# EAGLE board untitled (EAGLE 6.6.0)
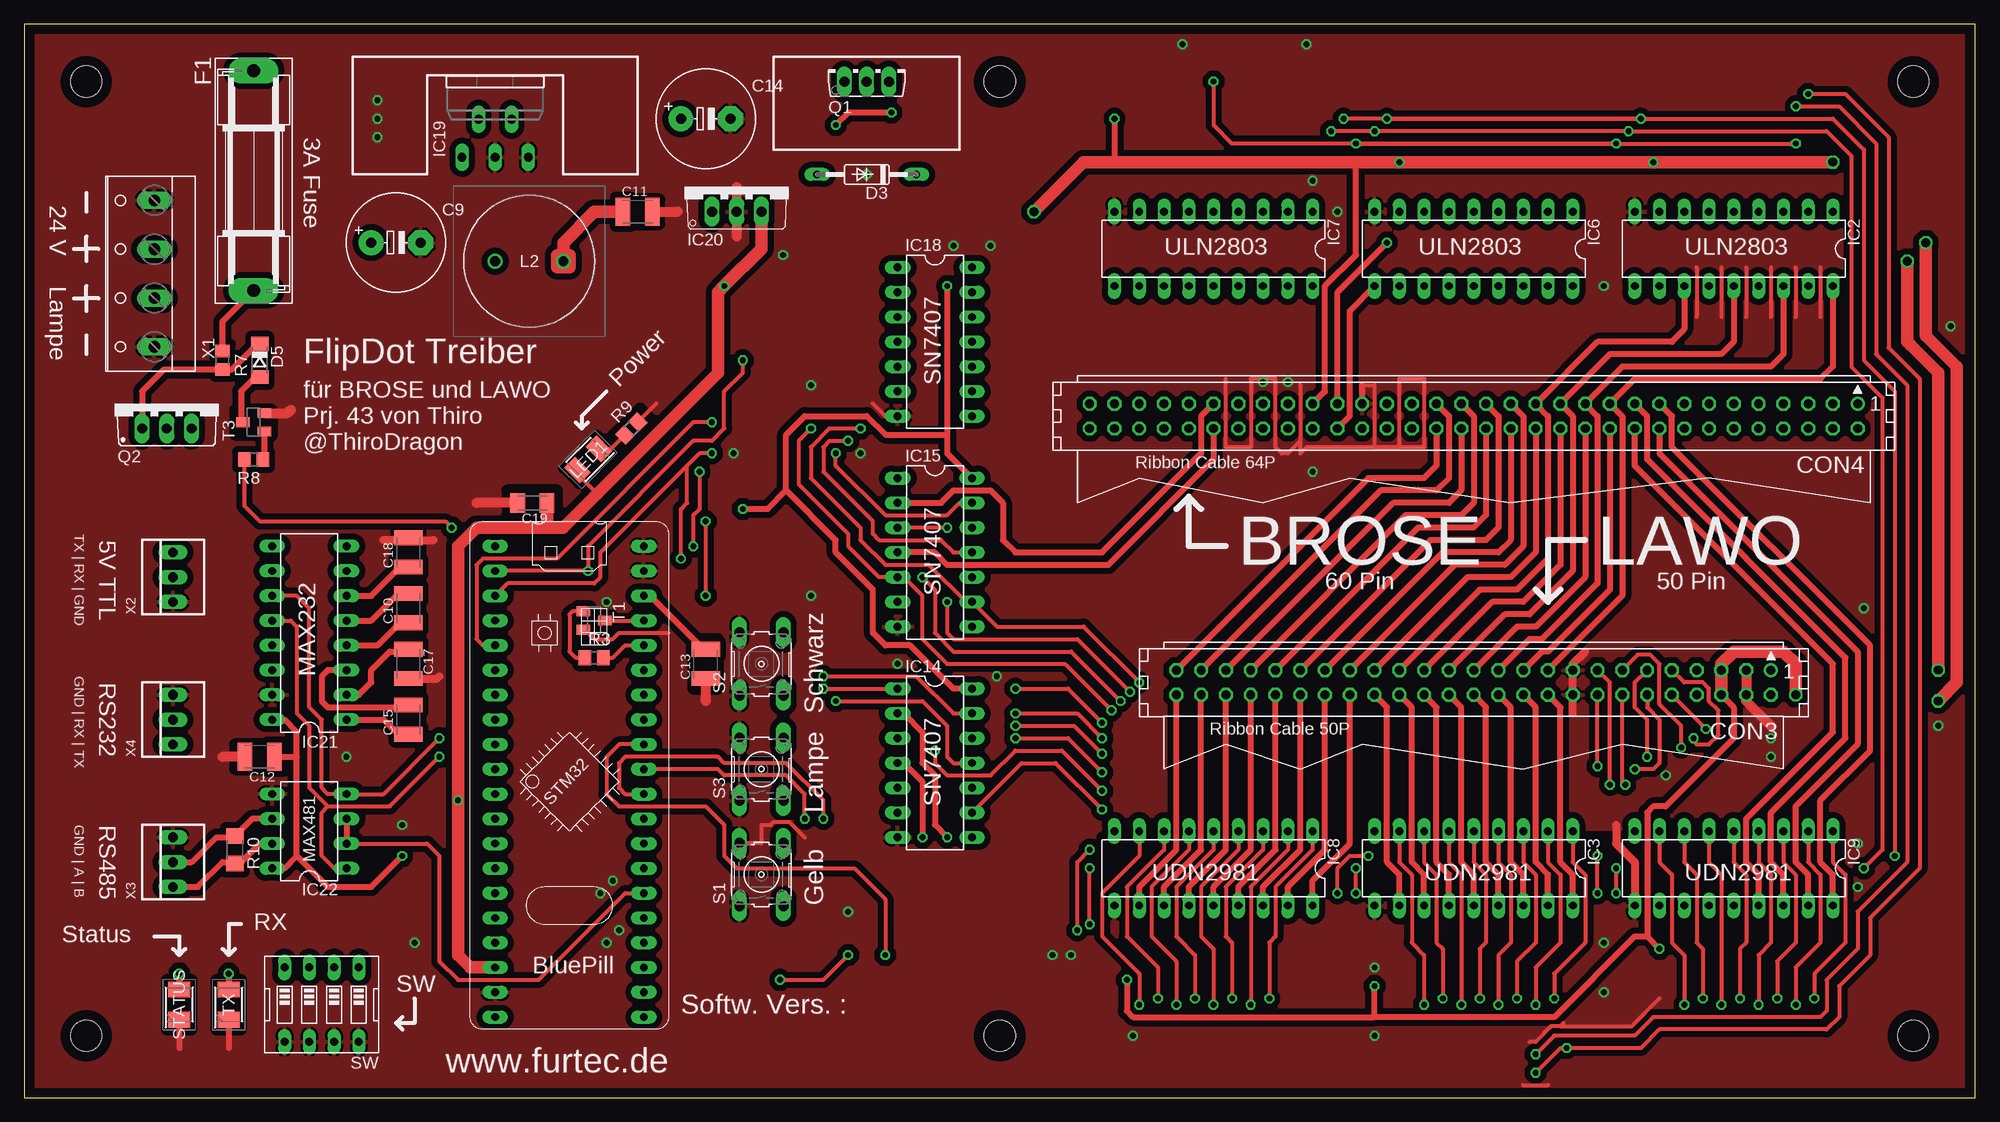
[diagram p4: board, top side]
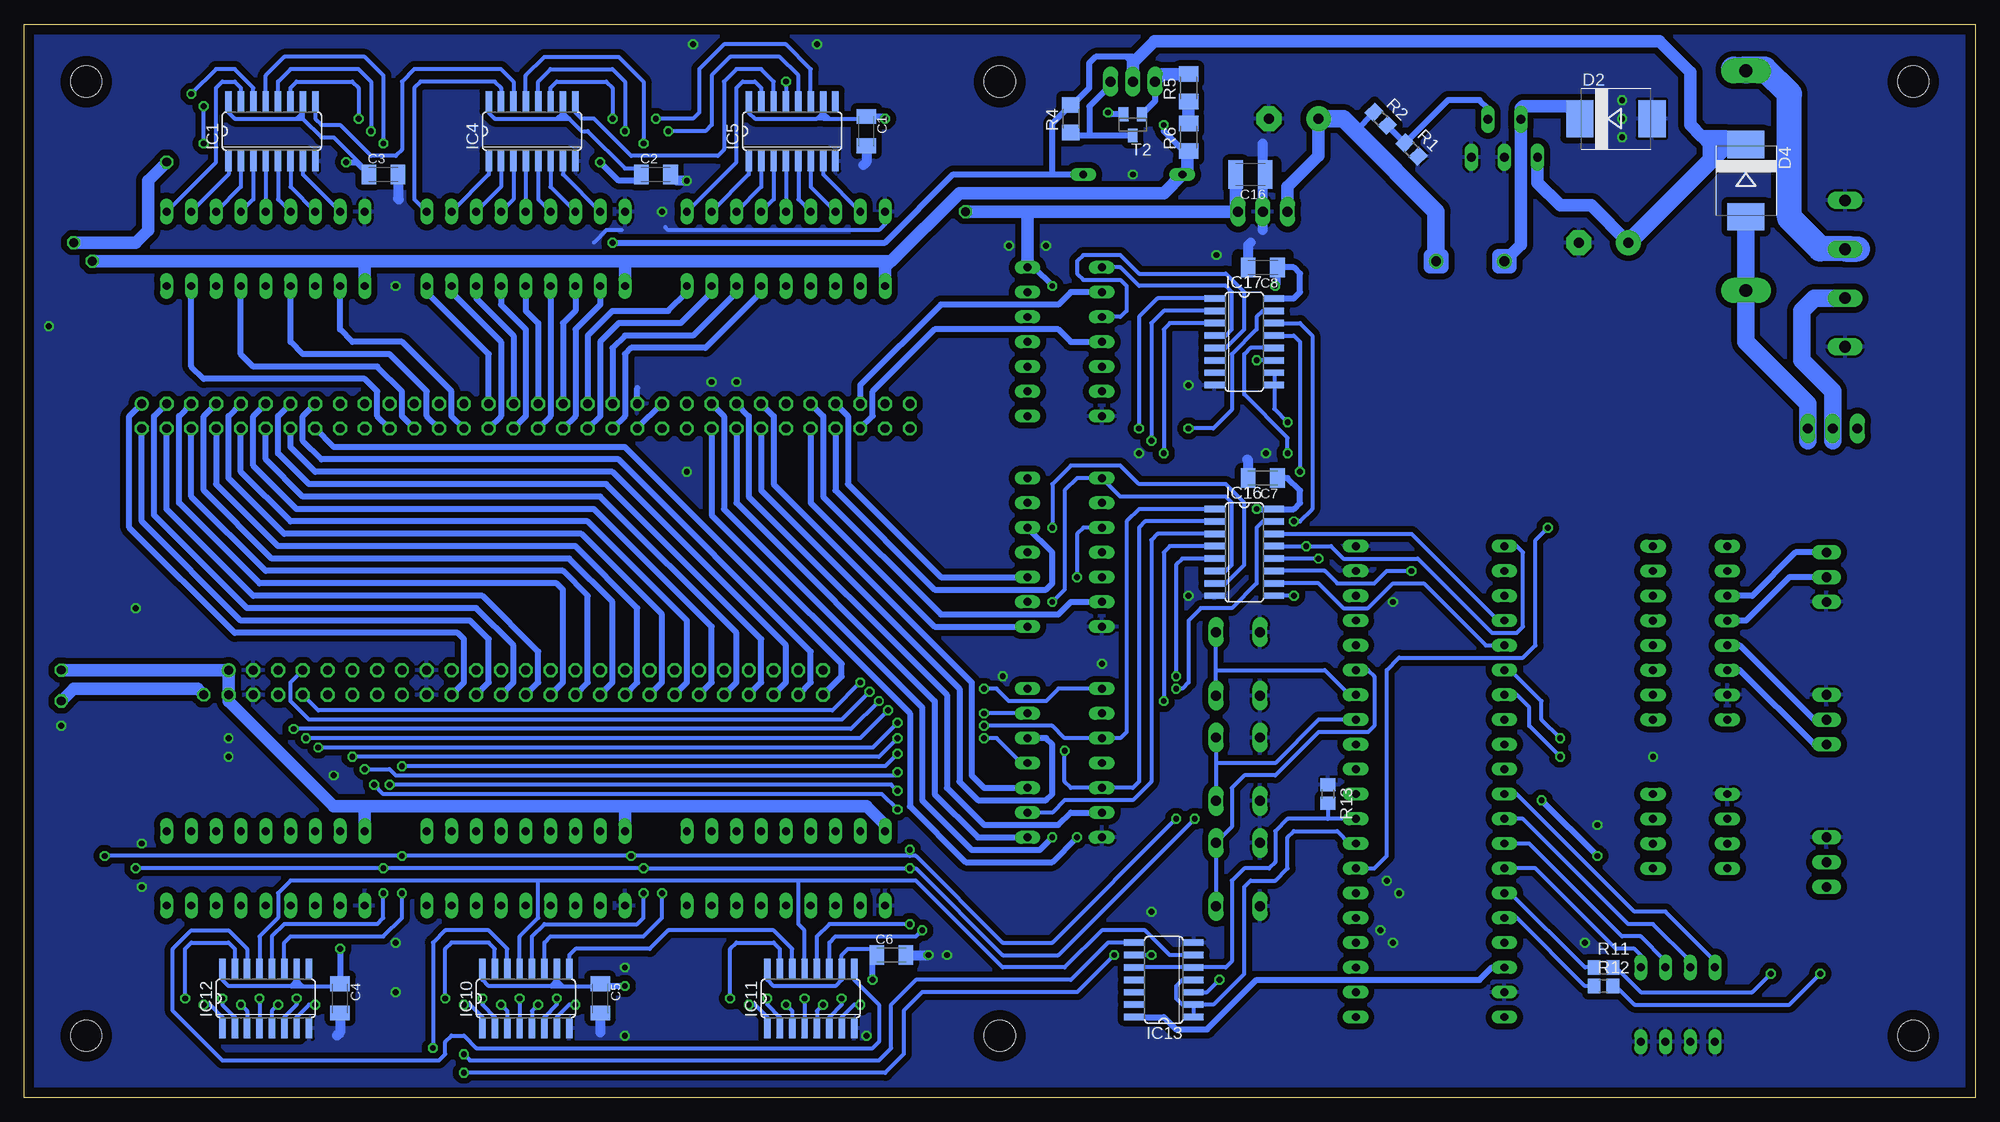
[diagram p5: board, bottom side, seen from below]

Size 200 x 110 mm. Coordinates in mm from the lower left corner, seen from the top.
Outline: 0,0 200,0 200,110 0,110 0,0
Copper layers (1*16): Top 0.035mm / dielectric 1.5mm / Bottom 0.035mm
Design rules "default": minimum track width 10mil, minimum drill 24mil, track to track 8mil, track to pad 8mil, pad to pad 8mil, via to via 8mil, smd to smd 8mil, copper to edge 40mil, drill to drill 8mil, minimum pad ring 10mil, minimum via ring 8mil, stop-mask expansion 4mil, vias tented up to drill 0mil, thermal gap 10mil
Holes 3.2 mm at 193.65,104.14 193.65,6.35 6.35,6.35 6.35,104.14 100,6.35 100,104.14
tRestrict: area 55.9,45.7 to 62.9,48.9; area 68.6,41.9 to 71.1,47; area 175.9,40.6 to 177.8,44.5; area 23.5,73.7 to 24.8,77.5; area 21.6,67.9 to 25.4,70.5; area 49.5,59.7 to 54.6,62.2; area 59.5,65.3 to 64.9,70.6; area 14.6,7 to 17.1,12.1; area 19.7,7 to 22.2,12.1; area 21.6,33.7 to 26.7,36.2; area 38.1,36.8 to 40.6,58.4; area 110.5,21 to 186.1,26.7; 1 more areas
bRestrict: area 71.8,93.3 to 76.2,95.9; area 70.5,83.8 to 75.6,86.4; area 70.8,62.5 to 75.2,64.5; area 108.9,13.7 to 113.3,15.6; area 140,7.9 to 141.9,12.4; area 166.7,7.9 to 168.6,12.4; area 161,93.7 to 165.4,95.6; area 133,93.7 to 137.5,95.6; area 112.7,96.8 to 114.6,101.3; area 111.8,87.9 to 114.6,90.2

## Footprints (pad centres in the part's own frame; a part is rotated, then mirrored left to right if it is on the bottom)
C1206K = smd 1.5 x 2: 1 -1.5,0; 2 1.5,0
E5-10,5 = drill 1.016 pad 2.54: + -2.54,0 | drill 1.016 pad 2.54 octagon: - 2.54,0
C1210K = smd 1.5 x 2.9: 1 -1.5,0; 2 1.5,0
CON50 = drill 0.914: 1 -30.48,-1.27 | drill 0.914 octagon: 2 -30.48,1.27; 3 -27.94,-1.27; 4 -27.94,1.27; 5 -25.4,-1.27; 6 -25.4,1.27; 7 -22.86,-1.27; 8 -22.86,1.27; 9 -20.32,-1.27; 10 -20.32,1.27; 11 -17.78,-1.27; 12 -17.78,1.27; 13 -15.24,-1.27; 14 -15.24,1.27; 15 -12.7,-1.27; 16 -12.7,1.27; 17 -10.16,-1.27; 18 -10.16,1.27; 19 -7.62,-1.27; 20 -7.62,1.27; 21 -5.08,-1.27; 22 -5.08,1.27; 23 -2.54,-1.27; 24 -2.54,1.27; 25 0,-1.27; 26 0,1.27; 27 2.54,-1.27; 28 2.54,1.27; 29 5.08,-1.27; 30 5.08,1.27; 31 7.62,-1.27; 32 7.62,1.27; 33 10.16,-1.27; 34 10.16,1.27; 35 12.7,-1.27; 36 12.7,1.27; 37 15.24,-1.27; 38 15.24,1.27; 39 17.78,-1.27; 40 17.78,1.27; 41 20.32,-1.27; 42 20.32,1.27; 43 22.86,-1.27; 44 22.86,1.27; 45 25.4,-1.27; 46 25.4,1.27; 47 27.94,-1.27; 48 27.94,1.27; 49 30.48,-1.27; 50 30.48,1.27
CON64 = drill 0.914: 1 -39.37,-1.27 | drill 0.914 octagon: 2 -39.37,1.27; 3 -36.83,-1.27; 4 -36.83,1.27; 5 -34.29,-1.27; 6 -34.29,1.27; 7 -31.75,-1.27; 8 -31.75,1.27; 9 -29.21,-1.27; 10 -29.21,1.27; 11 -26.67,-1.27; 12 -26.67,1.27; 13 -24.13,-1.27; 14 -24.13,1.27; 15 -21.59,-1.27; 16 -21.59,1.27; 17 -19.05,-1.27; 18 -19.05,1.27; 19 -16.51,-1.27; 20 -16.51,1.27; 21 -13.97,-1.27; 22 -13.97,1.27; 23 -11.43,-1.27; 24 -11.43,1.27; 25 -8.89,-1.27; 26 -8.89,1.27; 27 -6.35,-1.27; 28 -6.35,1.27; 29 -3.81,-1.27; 30 -3.81,1.27; 31 -1.27,-1.27; 32 -1.27,1.27; 33 1.27,-1.27; 34 1.27,1.27; 35 3.81,-1.27; 36 3.81,1.27; 37 6.35,-1.27; 38 6.35,1.27; 39 8.89,-1.27; 40 8.89,1.27; 41 11.43,-1.27; 42 11.43,1.27; 43 13.97,-1.27; 44 13.97,1.27; 45 16.51,-1.27; 46 16.51,1.27; 47 19.05,-1.27; 48 19.05,1.27; 49 21.59,-1.27; 50 21.59,1.27; 51 24.13,-1.27; 52 24.13,1.27; 53 26.67,-1.27; 54 26.67,1.27; 55 29.21,-1.27; 56 29.21,1.27; 57 31.75,-1.27; 58 31.75,1.27; 59 34.29,-1.27; 60 34.29,1.27; 61 36.83,-1.27; 62 36.83,1.27; 63 39.37,-1.27; 64 39.37,1.27
SMC = smd 2.8 x 3.8: A 3.7,0; C -3.7,0
DO35-10 = drill 0.813 long: A 5.08,0; C -5.08,0
SOD80C = smd 1.4 x 1.8: A 1.7,0; C -1.7,0
SH22,5 = drill 1.321 pad 2.54 long: 1 -11.252,0; 2 11.252,0
SO16 = smd 0.66 x 2.032: 1 -4.445,-3.073; 2 -3.175,-3.073; 3 -1.905,-3.073; 4 -0.635,-3.073; 5 0.635,-3.073; 6 1.905,-3.073; 7 3.175,-3.073; 8 4.445,-3.073; 9 4.445,3.073; 10 3.175,3.073; 11 1.905,3.073; 12 0.635,3.073; 13 -0.635,3.073; 14 -1.905,3.073; 15 -3.175,3.073; 16 -4.445,3.073
DIL18 = drill 0.813 long: 1 -10.16,-3.81; 2 -7.62,-3.81; 3 -5.08,-3.81; 4 -2.54,-3.81; 5 0,-3.81; 6 2.54,-3.81; 7 5.08,-3.81; 8 7.62,-3.81; 9 10.16,-3.81; 10 10.16,3.81; 11 7.62,3.81; 12 5.08,3.81; 13 2.54,3.81; 14 0,3.81; 15 -2.54,3.81; 16 -5.08,3.81; 17 -7.62,3.81; 18 -10.16,3.81
SO14 = smd 0.66 x 2.032: 1 -3.81,-3.073; 2 -2.54,-3.073; 3 -1.27,-3.073; 4 0,-3.073; 5 1.27,-3.073; 6 2.54,-3.073; 7 3.81,-3.073; 8 3.81,3.073; 9 2.54,3.073; 10 1.27,3.073; 11 0,3.073; 12 -1.27,3.073; 13 -2.54,3.073; 14 -3.81,3.073
DIL14 = drill 0.813 long: 1 -7.62,-3.81; 2 -5.08,-3.81; 3 -2.54,-3.81; 4 0,-3.81; 5 2.54,-3.81; 6 5.08,-3.81; 7 7.62,-3.81; 8 7.62,3.81; 9 5.08,3.81; 10 2.54,3.81; 11 0,3.81; 12 -2.54,3.81; 13 -5.08,3.81; 14 -7.62,3.81
TO220-5 = drill 0.9 long: 1 -3.4,-8.4; 2 -1.7,-4.5; 3 0,-8.4; 4 1.7,-4.5; 5 3.4,-8.4
TO220V = drill 1.016 long: 1 -2.54,-2.54; 2 0,-2.54; 3 2.54,-2.54
DIL16 = drill 0.813 long: 1 -8.89,-3.81; 2 -6.35,-3.81; 3 -3.81,-3.81; 4 -1.27,-3.81; 5 1.27,-3.81; 6 3.81,-3.81; 7 6.35,-3.81; 8 8.89,-3.81; 9 8.89,3.81; 10 6.35,3.81; 11 3.81,3.81; 12 1.27,3.81; 13 -1.27,3.81; 14 -3.81,3.81; 15 -6.35,3.81; 16 -8.89,3.81
DIL08 = drill 0.813 long: 1 -3.81,-3.81; 2 -1.27,-3.81; 3 1.27,-3.81; 4 3.81,-3.81; 5 3.81,3.81; 6 1.27,3.81; 7 -1.27,3.81; 8 -3.81,3.81
09HCP121M50 = drill 1 pad 1.5: 1 0,0; 2 7,0
LEDM3528X190N = smd 1.6 x 2.25: 1 -1.55,0; 2 1.55,0
TO126AV = drill 1.016 long: B 2.286,-1.27; C 0,-1.27; E -2.286,-1.27
TO220BV = drill 1.016 long: D 0,-2.54; G -2.54,-2.54; S 2.54,-2.54
R0805 = smd 1.3 x 1.5: 1 -0.95,0; 2 0.95,0
R1206 = smd 1.6 x 1.803: 1 -1.422,0; 2 1.422,0
M1206 = smd 1.6 x 2: 1 -1.4,0; 2 1.4,0
B3F-10XX = drill 1.016 long: 1 -3.251,2.261; 2 3.251,2.261; 3 -3.251,-2.261; 4 3.251,-2.261
EDG-04 = drill 0.813 long: 1 -3.81,-3.81; 2 -1.27,-3.81; 3 1.27,-3.81; 4 3.81,-3.81; 5 3.81,3.81; 6 1.27,3.81; 7 -1.27,3.81; 8 -3.81,3.81
SOT23 = smd 1 x 1.4: 1 -0.95,-1.1; 2 0.95,-1.1; 3 0,1.1
BLUE_PILL = drill 0.8 long: P$1 -7.62,15.24; P$2 -7.62,12.7; P$3 -7.62,10.16; P$4 -7.62,7.62; P$5 -7.62,5.08; P$6 -7.62,2.54; P$7 -7.62,0; P$8 -7.62,-2.54; P$9 -7.62,-5.08; P$10 -7.62,-7.62; P$11 -7.62,-10.16; P$12 -7.62,-12.7; P$13 -7.62,-15.24; P$14 -7.62,-17.78; P$15 -7.62,-20.32; P$16 -7.62,-22.86; P$17 -7.62,-25.4; P$18 -7.62,-27.94; P$19 -7.62,-30.48; P$20 -7.62,-33.02; P$21 7.62,15.24; P$22 7.62,12.7; P$23 7.62,10.16; P$24 7.62,7.62; P$25 7.62,5.08; P$26 7.62,2.54; P$27 7.62,0; P$28 7.62,-2.54; P$29 7.62,-5.08; P$30 7.62,-7.62; P$31 7.62,-10.16; P$32 7.62,-12.7; P$33 7.62,-15.24; P$34 7.62,-17.78; P$35 7.62,-20.32; P$36 7.62,-22.86; P$37 7.62,-25.4; P$38 7.62,-27.94; P$39 7.62,-30.48; P$40 7.62,-33.02
W237-4 = drill 1.194 long: 1 -7.5,-1.27; 2 -2.5,-1.27; 3 2.5,-1.27; 4 7.5,-1.27
22-23-2031 = drill 1 long: 1 -2.54,0; 2 0,0; 3 2.54,0

## Placement (x,y rotation side)
C1  100nF  [C1206K]  113.67,99.06 270 bottom
C2  100nF  [C1206K]  135.25,94.61 0 bottom
C3  100nF  [C1206K]  163.19,94.61 0 bottom
C4  100nF  [C1206K]  167.64,10.16 270 bottom
C5  100nF  [C1206K]  140.97,10.16 270 bottom
C6  100nF  [C1206K]  111.12,14.61 0 bottom
C7  100nF  [C1206K]  73.03,63.5 180 bottom
C8  100nF  [C1206K]  73.03,85.09 180 bottom
C9  470µF  [E5-10,5]  38.1,87.63 0 top
C10  4.7µ 50V  [C1210K]  39.37,50.16 90 top
C11  4.7µ 50V  [C1210K]  62.87,90.81 0 top
C12  4.7µ 50V  [C1210K]  24.13,34.92 180 top
C13  4.7µ 50V  [C1210K]  69.85,44.45 90 top
C14  470µF  [E5-10,5]  69.85,100.33 0 top
C15  4.7µ 50V  [C1210K]  39.37,38.73 90 top
C16  4.7µ 50V  [C1210K]  74.3,94.61 180 bottom
C17  4.7µ 50V  [C1210K]  39.37,44.45 270 top
C18  4.7µ 50V  [C1210K]  39.37,55.88 90 top
C19  100nF  [C1206K]  52.07,60.96 180 top
CON3  [CON50]  148.59,42.55 180 top
CON4  [CON64]  148.59,69.85 180 top
D2  MBRS360  [SMC]  36.83,100.33 0 bottom
D3  1N4148DO35-10  [DO35-10]  86.36,94.61 180 top
D4  MBRS360  [SMC]  23.5,93.98 270 bottom
D5  12V Z-Diode  [SOD80C]  24.13,75.56 270 top
F1  3A  [SH22,5]  23.5,93.98 270 top
IC1  74HCT595D  [SO16]  174.62,99.06 0 bottom
IC2  [DIL18]  175.26,87 180 top
IC3  UDN2981A  [DIL18]  148.59,23.5 180 top
IC4  74HCT595D  [SO16]  147.96,99.06 0 bottom
IC5  74HCT595D  [SO16]  121.28,99.06 0 bottom
IC6  [DIL18]  148.59,87 180 top
IC7  [DIL18]  121.92,87 180 top
IC8  UDN2981A  [DIL18]  121.92,23.5 180 top
IC9  UDN2981A  [DIL18]  175.26,23.5 180 top
IC10  74HCT595D  [SO16]  148.59,10.16 0 bottom
IC11  74HCT595D  [SO16]  119.38,10.16 0 bottom
IC12  74HCT595D  [SO16]  175.26,10.16 0 bottom
IC13  74HCT00D  [SO14]  83.19,12.06 90 bottom
IC14  7407N  [DIL14]  93.34,34.29 270 top
IC15  7407N  [DIL14]  93.34,55.88 270 top
IC16  74HCT595D  [SO16]  74.93,55.88 270 bottom
IC17  74HCT595D  [SO16]  74.93,77.47 270 bottom
IC18  7407N  [DIL14]  93.34,77.47 270 top
IC19  LM2576T-ADJ  [TO220-5]  48.26,104.78 0 top
IC20  7805TV  [TO220V]  73.03,93.34 0 top
IC21  MAX232  [DIL16]  29.21,47.62 90 top
IC22  MAX481CPA  [DIL08]  29.21,27.3 90 top
L2  100µ  [09HCP121M50]  48.26,85.72 0 top
LED1  PLCC_Green  [LEDM3528X190N]  57.78,65.41 225 top
Q1  BD441  [TO126AV]  86.36,105.41 0 top
Q2  IRF5305  [TO220BV]  14.61,71.12 0 top
R1  1k  [R0805]  57.78,97.16 315 bottom
R2  4.7k  [R0805]  60.96,100.33 315 bottom
R3  4.7k  [R0805]  58.42,45.09 0 top
R4  1k 1206  [R1206]  92.71,100.33 90 bottom
R5  1 Ohm  [M1206]  80.64,103.5 90 bottom
R6  1 Ohm  [M1206]  80.64,98.42 90 bottom
R7  39k  [R0805]  20.32,75.56 270 top
R8  4.7k  [R0805]  23.5,65.41 180 top
R9  4.7k  [R0805]  62.23,68.58 45 top
R10  150 R  [R1206]  21.59,25.4 270 top
R11  4.7k  [R0805]  38.1,13.34 0 bottom
R12  4.7k  [R0805]  38.1,11.43 0 bottom
R13  10k  [R0805]  66.36,31.11 270 bottom
S1  Test_Gelb  [B3F-10XX]  75.56,22.86 90 top
S2  Test_Schwarz  [B3F-10XX]  75.56,44.45 90 top
S3  Test_Lampe  [B3F-10XX]  75.56,33.66 90 top
STATUS  PLCC_Green  [LEDM3528X190N]  15.88,9.53 90 top
SW  [EDG-04]  30.48,9.53 180 top
T1  BC847  [SOT23]  58.42,48.9 270 top
T2  BC847  [SOT23]  86.36,99.69 180 bottom
T3  BC847  [SOT23]  23.5,69.22 90 top
TX  PLCC_Green  [LEDM3528X190N]  20.95,9.53 90 top
U$1  [BLUE_PILL]  55.88,41.27 0 top
X1  [W237-4]  12.06,84.45 90 top
X2  UART 5V TTL  [22-23-2031]  15.24,53.34 90 top
X3  RS485  [22-23-2031]  15.24,24.13 90 top
X4  RS232  [22-23-2031]  15.24,38.73 90 top

## Tracks (layer width: path | path; a pad name or v marks a point on that pad's centre or on a via)
BROSE_A0  (via drill 0.6)
  Top 0.61: IC14.4 90.17,34.29 92.08,32.38 v92.08,26.67
  Bottom 0.61: CON4.48 129.54,59.69 109.22,39.37 109.22,29.84 103.5,24.13 94.61,24.13 v92.08,26.67
BROSE_A1
  Bottom 0.61: CON4.49 125.73,69.85 125.73,61.59 105.41,41.27 105.41,31.75 101.6,27.94 93.98,27.94 92.71,29.21 IC14.6
BROSE_A2
  Bottom 0.61: CON4.50 127,60.96 106.68,40.64 106.68,31.11 102.23,26.67 IC14.8
BROSE_B0
  Bottom 0.61: IC14.10 101.6,31.75 102.87,33.02 102.87,42.55 123.19,62.87 123.19,69.85 CON4.51
BROSE_B1
  Bottom 0.61: CON4.52 124.46,62.23 104.14,41.91 104.14,32.38 102.23,30.48 95.25,30.48 94.61,31.11 94.61,36.2 95.25,36.83 IC14.12
BROSE_D  (via drill 0.6)
  Top 0.61: v94.61,26.67 93.34,27.94 93.34,33.02 92.08,34.29 92.08,37.47 90.17,39.37 IC14.2
  Bottom 0.61: CON4.47 128.27,69.85 128.27,60.33 107.95,40.01 107.95,30.48 102.87,25.4 95.89,25.4 v94.61,26.67
BROSE_M1
  Top 0.61: CON4.53 120.65,69.85 120.65,66.04 110.49,55.88 101.6,55.88 100.33,57.15 100.33,60.96 99.06,62.23 95.25,62.23 93.98,60.96 IC15.2
BROSE_M2
  Top 0.61: CON4.54 121.92,65.41 111.12,54.61 94.61,54.61 93.34,55.88 IC15.4
BROSE_M3
  Bottom 0.61: CON4.55 118.11,69.85 118.11,61.59 106.05,49.53 93.98,49.53 92.71,50.8 IC15.6
BROSE_M4
  Bottom 0.61: CON4.56 119.38,60.96 106.68,48.26 IC15.8
BROSE_M5
  Bottom 0.61: CON4.57 115.57,69.85 115.57,62.87 106.05,53.34 IC15.10
BROSE_M6
  Bottom 0.61: CON4.58 116.84,62.23 106.68,52.07 95.25,52.07 94.61,52.7 94.61,55.88 IC15.12
BROSE_M7
  Bottom 0.61: IC18.2 92.71,82.55 93.98,81.28 106.05,81.28 114.3,73.03 CON4.59
BROSE_M8
  Bottom 0.61: CON4.60 113.03,69.85 113.03,72.39 106.68,78.74 93.98,78.74 92.71,77.47 IC18.4
GND  (via drill 0.6)
  Top 0.406: IC18.7 88.27,69.85 87,71.12 | 171.45,85.09 171.45,80.01 | 173.99,85.09 173.99,80.01 | 176.53,85.09 176.53,80.01 | 179.07,85.09 179.07,80.01 | 181.61,85.09 181.61,80.01 | 184.15,85.09 184.15,80.01 | T1.2 57.47,47.95 58.42,46.99 60.33,46.99 60.96,47.62 66.04,47.62 | 153.67,1.27 156.21,1.27 | R9.2 64.77,71.12 | CON4.41 137.16,71.44 | 137.16,73.03 138.43,73.03 138.43,66.67 140.97,66.67 140.97,73.66 143.51,73.66 143.51,66.67 131.44,66.67 130.81,66.04 130.81,67.31 | 130.81,73.03 130.81,67.31 | 130.81,67.31 129.54,66.04 128.91,66.04 128.27,66.67 128.27,73.66 125.73,73.66 125.73,66.67 123.19,66.67 123.19,73.66 | S1.2 75.49,26.11 75.56,26.04 75.56,27.94 76.52,27.94 76.83,28.26 78.42,28.26 80.01,26.67 | 157.8,7.62 157.48,7.3 | 157.48,7.3 156.53,7.3 154.94,5.71 154.31,5.71 | 157.48,7.3 164.78,7.3 167.64,10.16
  Top 0.61: TX.1 20.95,5.08 | STATUS.1 15.88,5.08 | 137.16,71.44 137.16,73.03
  Top 0.813: C18.2 38.97,57.38 38.73,57.15 | 38.73,57.15 36.83,57.15 | 38.73,57.15 41.91,57.15 | C17.2 42.31,42.95 42.55,43.18 | 163.19,27.94 163.19,26.04 165.1,24.13 IC9.10 | 158.75,39.37 158.75,44.45 160.02,45.72
  Top 1.016: C13.1 69.85,40.64 | CON3.3 CON3.4 176.53,40.64 179.07,38.1 | T3.2 26.98,70.17 27.3,70.48 | C19.2 46.35,60.96 | C12.2 20.32,34.92 | C11.2 66.99,90.81 | 73.03,93.34 73.03,88.27
  Bottom 0.406: 111.76,90.49 111.76,89.53 112.39,88.9 133.99,88.9 134.3,89.22 | 138.75,88.9 140.34,88.9 141.6,87.63
  Bottom 0.61: CON4.41 137.16,72.71
  Bottom 1.016: 73.03,88.9 IC20.2 73.03,94.39 C16.1 | 73.03,94.61 73.03,97.79 | C8.2 74.53,87.4 74.3,87.63 | C4.2 167.64,6.67 167.96,6.35 | C5.2 140.97,6.67 | C6.2 v107.31,14.61 | C7.2 74.53,65.32 74.61,65.41 | C1.2 113.67,95.89 113.98,95.57 | v132.08,93.98 133.12,93.98 C2.2 | C3.2 161.69,92.16 161.61,92.08
  other vias: 132.08,64.14 85.72,66.04 99.69,43.18 161.93,15.88 187.96,26.04 187.96,21.59 188.59,50.16 161.93,10.79 179.07,36.83 179.07,34.92 38.73,27.94 33.02,34.92 36.2,102.23 36.2,100.33 36.2,98.42 161.93,83.19 138.43,13.34 105.41,14.61 113.67,6.35 84.45,19.05 138.43,6.35 89.53,44.45 80.64,51.44 80.64,73.03 59.69,15.88 60.96,17.14 60.33,22.23 59.05,20.95 40.01,15.88 59.69,50.8 168.28,33.02 86.36,94.61 118.75,107.95 131.44,107.95 134.62,90.81 129.54,73.34 127,73.34 196.22,38.1 197.49,79.06 72.71,66.04 77.79,86.36 95.25,87.31 99.06,87.31
  pour Top (isolate 0.61): 0,0 200.03,0 200.03,109.86 0,109.86
  pour Bottom (isolate 0.61): 0,0 200.03,0 200.03,109.86 0,109.86
LAMPE  (via drill 0.6)
  Top 0.406: R8.2 22.55,60.64 24.13,59.05 43.18,59.05 v43.81,58.42
  Bottom 0.406: U$1.P$34 61.59,23.5 60.33,24.77 60.33,43.81 59.05,45.09 46.35,45.09 45.09,46.35 45.09,57.15 v43.81,58.42
LAWO_A0  (via drill 0.6)
  Top 0.406: v101.6,38.1 107.63,38.1 v110.49,35.24 | v161.29,33.97 CON3.16
  Bottom 0.406: IC16.1 85.72,60.33 87,59.05 87,37.47 87.63,36.83 IC14.3 93.34,36.83 94.61,38.1 v101.6,38.1 | v161.29,33.97 111.76,33.97 v110.49,35.24
LAWO_A1  (via drill 0.6)
  Top 0.406: v93.34,35.56 93.34,34.29 94.61,33.02 99.06,33.02 101.6,35.56 106.36,35.56 v110.49,31.43 | v162.56,32.07 162.56,42.55 CON3.15
  Bottom 0.406: IC16.2 85.09,59.05 85.72,58.42 85.72,32.38 86.36,31.75 IC14.5 92.71,31.75 93.34,32.38 v93.34,35.56 | v110.49,31.43 111.12,32.07 v162.56,32.07
LAWO_A2  (via drill 0.6)
  Top 0.406: IC14.9 102.23,34.29 105.73,34.29 v110.49,29.53 | CON3.14 163.83,32.38 v164.15,32.07
  Bottom 0.406: IC16.3 83.82,57.78 84.45,57.15 84.45,32.38 86.36,30.48 93.34,30.48 94.61,29.21 IC14.9 | v110.49,29.53 112.08,31.11 163.19,31.11 v164.15,32.07
LAWO_B0  (via drill 0.6)
  Top 0.406: v83.19,40.64 92.08,40.64 94.61,38.1 94.61,34.92 95.25,34.29 IC14.11 | v101.6,36.83 107,36.83 v110.49,33.34 | CON3.12 166.37,40.01 167.64,38.73 167.64,34.29 167,33.66 v165.1,33.66
  Bottom 0.406: IC16.4 82.55,56.52 83.19,55.88 v83.19,40.64 | IC14.11 97.79,34.29 100.33,36.83 v101.6,36.83 | v165.1,33.66 162.56,33.66 161.93,33.02 110.81,33.02 v110.49,33.34
LAWO_B1  (via drill 0.6)
  Top 0.406: v81.92,43.18 91.44,43.18 95.25,39.37 IC14.13 | v101.6,39.37 107.95,39.37 v110.49,36.83 | v166.37,34.92 166.37,38.73 165.1,40.01 165.1,42.55 CON3.11
  Bottom 0.406: IC16.5 81.28,55.24 81.92,54.61 v81.92,43.18 | IC14.13 v101.6,39.37 | v166.37,34.92 112.39,34.92 v110.49,36.83
LAWO_D  (via drill 0.6)
  Top 0.406: v101.6,41.91 107,41.91 v110.49,38.42 | v169.86,35.88 169.86,38.1 167.64,40.32 167.64,44.45 166.69,45.4 165.42,45.4 CON3.13 | v81.92,41.91 IC14.1
  Bottom 0.406: IC14.1 93.98,41.91 95.25,40.64 99.06,40.64 100.33,41.91 v101.6,41.91 | v169.86,35.88 113.03,35.88 v110.49,38.42 | IC16.15 73.03,59.05 73.66,58.42 73.66,52.7 76.2,50.16 79.38,50.16 80.64,48.9 80.64,42.55 81.28,41.91 v81.92,41.91
LAWO_M1  (via drill 0.6)
  Top 0.406: v94.61,50.8 94.61,47.62 95.25,46.99 107.95,46.99 v113.35,41.59
  Bottom 0.406: v94.61,50.8 93.34,52.07 93.34,62.23 92.08,63.5 IC15.1 87.63,61.59 76.83,61.59 76.2,60.96 76.2,54.61 76.83,53.98 IC16.6 | v113.35,41.59 116.2,38.73 170.81,38.73 172.72,40.64 172.72,42.55 CON3.7
LAWO_M2  (via drill 0.6)
  Top 0.406: v92.08,53.34 93.34,52.07 93.34,47.62 95.25,45.72 107.31,45.72 v112.39,40.64 | CON3.10 v172.4,37.78 | v94.61,58.42 IC15.3
  Bottom 0.406: IC15.3 91.44,58.42 92.08,57.78 v92.08,53.34 | v112.39,40.64 115.25,37.78 v172.4,37.78 | v94.61,58.42 94.61,62.87 92.71,64.77 87.63,64.77 85.72,62.87 76.83,62.87 74.93,60.96 74.93,54.61 76.83,52.7 IC16.7
LAWO_M3  (via drill 0.6)
  Top 0.406: v111.44,39.69 106.68,44.45 94.61,44.45 92.08,46.99 92.08,51.44 90.17,53.34 IC15.5 87.63,53.34 84.45,56.52 84.45,57.78 79.38,62.87 79.38,67.31 v80.64,68.58 | CON3.9 170.18,42.55 172.09,42.55 172.72,41.91 172.72,40.64 173.67,39.69 173.67,37.15 172.72,36.2 171.45,36.2 171.13,36.51 v171.13,36.83
  Bottom 0.406: v111.44,39.69 114.3,36.83 v171.13,36.83 | IC17.15 73.03,80.64 73.66,80.01 73.66,78.74 76.2,76.2 76.2,70.48 78.11,68.58 v80.64,68.58
LAWO_M4  (via drill 0.6)
  Top 0.406: v114.3,42.55 108.58,48.26 99.69,48.26 IC15.9 96.52,50.8 92.71,54.61 88.27,54.61 85.72,57.15 85.72,58.42 80.64,63.5 80.64,66.67 82.55,68.58 v85.72,68.58
  Bottom 0.406: v114.3,42.55 117.16,39.69 169.86,39.69 CON3.8 | IC17.1 83.82,81.92 85.72,80.01 v85.72,68.58
LAWO_M5  (via drill 0.6)
  Top 0.406: 97.79,55.88 IC15.11 95.25,55.88 93.98,57.15 87.63,57.15 87,57.78 87,59.05 81.92,64.14 81.92,66.67 82.55,67.31 v84.45,67.31
  Bottom 0.406: IC17.2 83.19,80.64 84.45,79.38 v84.45,67.31
LAWO_M6  (via drill 0.6)
  Top 0.406: IC15.13 95.89,60.96 94.61,59.69 88.27,59.69 83.19,64.77 v83.19,66.04
  Bottom 0.406: IC17.3 82.55,79.38 83.19,78.74 v83.19,66.04
LAWO_M7
  Bottom 0.406: IC17.4 76.83,78.11 76.2,78.74 76.2,82.55 76.83,83.19 85.72,83.19 87.63,85.09 IC18.1
LAWO_M8
  Bottom 0.406: IC17.5 76.83,76.83 74.93,78.74 74.93,82.55 76.83,84.45 85.72,84.45 87.63,86.36 91.44,86.36 92.08,85.72 92.08,84.45 91.44,83.82 87.63,83.82 87,83.19 87,80.64 87.63,80.01 IC18.3
N$1
  Bottom 0.406: IC1.9 170.18,100.33 169.54,99.69 167.64,99.69 164.47,96.52 161.93,96.52 161.29,97.16 161.29,104.14 160.02,105.41 151.13,105.41 149.86,104.14 IC4.14
N$2
  Bottom 0.406: IC5.14 123.19,104.14 124.46,105.41 127,105.41 128.27,104.14 128.27,97.16 128.91,96.52 137.79,96.52 141.6,100.33 142.88,100.33 143.51,100.97 IC4.9
N$3
  Bottom 0.406: IC4.15 151.13,103.5 151.76,104.14 159.38,104.14 160.02,103.5 160.02,92.08 IC6.1
N$4
  Bottom 0.406: IC4.1 152.4,94.61 IC6.2
N$5
  Bottom 0.406: IC4.2 151.13,93.34 IC6.3
N$6
  Bottom 0.406: IC4.3 149.86,92.08 IC6.4
N$7
  Bottom 0.406: IC4.4 IC6.5
N$8
  Bottom 0.406: IC4.5 147.32,92.08 IC6.6
N$9
  Bottom 0.406: IC4.6 146.05,93.34 IC6.7
N$10
  Bottom 0.406: IC4.7 144.78,94.61 IC6.8
N$11
  Bottom 0.406: IC2.1 180.34,95.89 180.34,103.5 179.71,104.14 178.44,104.14 177.8,103.5 IC1.15
N$12
  Bottom 0.406: IC1.1 179.07,94.61 IC2.2
N$13
  Bottom 0.406: IC1.2 177.8,93.34 IC2.3
N$14
  Bottom 0.406: IC1.3 176.53,92.08 IC2.4
N$15
  Bottom 0.406: IC1.4 IC2.5
N$16
  Bottom 0.406: IC1.5 173.99,92.08 IC2.6
N$17
  Bottom 0.406: IC1.6 172.72,93.34 IC2.7
N$18
  Bottom 0.406: IC1.7 171.45,94.61 IC2.8
N$19
  Bottom 0.406: IC7.1 127,95.89 127,103.5 126.36,104.14 125.09,104.14 124.46,103.5 IC5.15
N$20
  Bottom 0.406: IC5.1 125.73,94.61 IC7.2
N$21
  Bottom 0.406: IC5.2 124.46,93.34 IC7.3
N$22
  Bottom 0.406: IC5.3 123.19,92.08 IC7.4
N$23
  Bottom 0.406: IC5.4 IC7.5
N$24
  Bottom 0.406: IC5.5 120.65,92.08 IC7.6
N$25
  Bottom 0.406: IC5.6 119.38,93.34 IC7.7
N$26
  Bottom 0.406: IC5.7 118.11,94.61 IC7.8
N$27  (via drill 0.6)
  Top 0.406: IC3.2 156.21,24.13 157.48,22.86 157.48,15.88 154.94,13.34 v154.94,9.53
  Bottom 0.406: v154.94,9.53 154.31,9.53 153.03,8.26 IC10.1
N$28  (via drill 0.6)
  Top 0.406: IC3.3 153.67,24.13 154.94,22.86 154.94,15.88 153.03,13.97 v153.03,10.16
  Bottom 0.406: v153.03,10.16 153.03,9.53 151.76,8.26 IC10.2
N$29  (via drill 0.6)
  Top 0.406: IC3.4 151.13,24.13 152.4,22.86 152.4,15.88 151.13,14.61 v151.13,9.53
  Bottom 0.406: v151.13,9.53 150.5,8.89 IC10.3
N$30  (via drill 0.6)
  Top 0.406: IC3.5 148.59,24.13 149.86,22.86 149.86,15.88 149.22,15.24 v149.22,10.16
  Bottom 0.406: v149.22,10.16 IC10.4
N$31  (via drill 0.6)
  Top 0.406: IC3.6 146.05,24.13 147.32,22.86 v147.32,9.53
  Bottom 0.406: v147.32,9.53 147.96,8.89 IC10.5
N$32  (via drill 0.6)
  Top 0.406: IC3.7 143.51,24.13 144.78,22.86 144.78,15.88 145.41,15.24 v145.41,10.16
  Bottom 0.406: v145.41,10.16 145.41,9.53 146.69,8.26 IC10.6
N$33  (via drill 0.6)
  Top 0.406: IC3.8 140.97,24.13 142.24,22.86 142.24,15.88 143.51,14.61 v143.51,9.53
  Bottom 0.406: v143.51,9.53 144.15,9.53 145.41,8.26 IC10.7
N$34  (via drill 0.6)
  Top 0.406: IC3.1 158.75,24.13 160.02,22.86 160.02,15.88 156.84,12.7 v156.84,10.16
  Bottom 0.406: v156.84,10.16 156.84,15.24 156.21,15.88 152.4,15.88 151.76,15.24 IC10.15
N$35  (via drill 0.6)
  Top 0.406: IC8.2 129.54,25.4 125.73,21.59 v125.73,9.53
  Bottom 0.406: v125.73,9.53 125.09,9.53 123.83,8.26 IC11.1
N$36  (via drill 0.6)
  Top 0.406: IC8.3 127,25.4 123.19,21.59 123.19,16.51 123.83,15.88 v123.83,10.16
  Bottom 0.406: v123.83,10.16 123.83,9.53 122.56,8.26 IC11.2
N$37  (via drill 0.6)
  Top 0.406: IC8.4 124.46,25.4 120.65,21.59 120.65,16.51 121.92,15.24 v121.92,9.53
  Bottom 0.406: v121.92,9.53 121.28,8.89 IC11.3
N$38  (via drill 0.6)
  Top 0.406: IC8.5 121.92,25.4 118.11,21.59 118.11,16.51 120.02,14.61 v120.02,10.16
  Bottom 0.406: v120.02,10.16 IC11.4
N$39  (via drill 0.6)
  Top 0.406: IC8.6 119.38,25.4 115.57,21.59 115.57,16.51 118.11,13.97 v118.11,9.53
  Bottom 0.406: v118.11,9.53 118.75,8.89 IC11.5
N$40  (via drill 0.6)
  Top 0.406: IC8.7 116.84,25.4 113.03,21.59 113.03,16.51 116.2,13.34 v116.2,10.16
  Bottom 0.406: v116.2,10.16 116.2,9.53 117.47,8.26 IC11.6
N$41  (via drill 0.6)
  Top 0.406: IC8.8 114.3,24.77 110.49,20.95 110.49,16.51 114.3,12.7 v114.3,9.53
  Bottom 0.406: v114.3,9.53 114.94,9.53 116.2,8.26 IC11.7
N$42  (via drill 0.6)
  Top 0.406: IC8.1 132.08,25.4 128.27,21.59 128.27,16.51 127.64,15.88 v127.64,10.16
  Bottom 0.406: v127.64,10.16 127.64,15.24 127,15.88 123.19,15.88 122.56,15.24 IC11.15
N$43  (via drill 0.6)
  Top 0.406: IC9.2 182.88,24.13 184.15,22.86 184.15,15.88 181.61,13.34 v181.61,9.53
  Bottom 0.406: v181.61,9.53 180.97,9.53 179.71,8.26 IC12.1
N$44  (via drill 0.6)
  Top 0.406: IC9.3 180.34,24.13 181.61,22.86 181.61,15.88 179.71,13.97 v179.71,10.16
  Bottom 0.406: v179.71,10.16 179.71,9.53 178.44,8.26 IC12.2
N$45  (via drill 0.6)
  Top 0.406: IC9.4 177.8,24.13 179.07,22.86 179.07,15.88 177.8,14.61 v177.8,9.53
  Bottom 0.406: v177.8,9.53 177.16,8.89 IC12.3
N$46  (via drill 0.6)
  Top 0.406: IC9.5 175.26,24.13 176.53,22.86 176.53,15.88 175.9,15.24 v175.9,10.16
  Bottom 0.406: v175.9,10.16 IC12.4
N$47  (via drill 0.6)
  Top 0.406: IC9.6 172.72,24.13 173.99,22.86 v173.99,9.53
  Bottom 0.406: v173.99,9.53 174.62,8.89 IC12.5
N$48  (via drill 0.6)
  Top 0.406: IC9.7 170.18,24.13 171.45,22.86 171.45,15.88 172.09,15.24 v172.09,10.16
  Bottom 0.406: v172.09,10.16 172.09,9.53 173.35,8.26 IC12.6
N$49  (via drill 0.6)
  Top 0.406: IC9.8 167.64,24.13 168.91,22.86 168.91,15.88 170.18,14.61 v170.18,9.53
  Bottom 0.406: v170.18,9.53 170.81,9.53 172.09,8.26 IC12.7
N$50  (via drill 0.6)
  Top 0.406: IC9.1 185.42,24.13 186.69,22.86 186.69,15.88 183.51,12.7 v183.51,10.16
  Bottom 0.406: v183.51,10.16 183.51,15.24 182.88,15.88 179.07,15.88 178.44,15.24 IC12.15
N$51
  Bottom 0.406: IC11.14 121.28,15.24 123.19,17.14 133.99,17.14 135.89,15.24 143.51,15.24 144.15,14.61 IC10.9
N$52
  Bottom 0.406: IC12.14 177.16,15.24 179.07,17.14 182.88,17.14 184.78,15.24 184.78,8.89 179.71,3.81 157.48,3.81 156.84,4.45 156.84,5.71 156.21,6.35 154.94,6.35 153.67,5.08 113.03,5.08 112.39,5.71 112.39,9.53 114.94,12.06 IC11.9
N$53
  Bottom 1.27: R5.1 R6.2
N$54
  Top 0.61: D5.A 23.7,73.86 22.23,72.39 22.23,69.39 T3.3
N$55
  Bottom 2.54: X1.3 12.06,86.95 12.7,87 15.88,87 19.05,90.17 19.05,102.87 21.59,105.41 23.67,105.41 | 24.77,105.41 23.67,105.41 | 23.67,105.41 F1.1
N$56
  Top 0.61: Q2.G 12.06,72.39 14.29,74.61 R7.2 21.27,74.61 23.5,76.83 23.7,76.83 D5.C
N$57
  Top 0.61: R7.1 20.32,79.55 F1.2
  Bottom 1.778: D4.A F1.2 23.5,77.47 17.14,71.12 Q2.S 17.14,67.31
N$58
  Top 0.61: T3.1 24.59,65.56 R8.1
N$59
  Bottom 0.406: SW.1 34.29,14.61 34.92,15.24 36.83,15.24 45.09,23.5 U$1.P$14
N$60
  Bottom 0.406: SW.2 31.75,13.97 34.29,16.51 36.2,16.51 45.72,26.04 U$1.P$13
N$61
  Bottom 0.406: SW.3 29.21,13.97 33.02,17.78 35.56,17.78 46.35,28.57 U$1.P$12
N$62
  Bottom 0.406: SW.4 26.67,13.97 31.75,19.05 34.92,19.05 46.99,31.11 U$1.P$11
N$63
  Top 0.406: LED1.1 60.15,66.5 | 60.15,66.5 60.33,66.67 | 60.15,66.5 59.69,66.04 | 60.15,66.5 R9.1
N$64
  Top 0.61: X3.2 17.14,24.13 19.68,26.67 21.44,26.67 R10.1 23.34,28.57 IC22.6
N$65
  Top 0.61: X3.1 17.78,21.59 20.32,24.13 21.44,24.13 R10.2 21.74,24.13 22.23,24.13 24.13,26.04 IC22.7
N$66
  Top 0.61: IC21.5 35.56,48.9 38.1,51.44 39.14,51.44 C10.2
N$67
  Top 0.61: IC21.4 36.2,46.35 38.1,48.26 38.97,48.26 C10.1
N$68
  Bottom 0.61: X4.1 16.51,36.2 24.13,43.81 IC21.14
N$69
  Top 0.61: IC21.3 31.11,43.81 30.48,43.18 30.48,40.64 31.11,40.01 39.14,40.01 C15.2
N$70
  Top 0.61: IC21.1 36.83,38.73 38.1,37.47 39.14,37.47 C15.1
N$71
  Bottom 0.61: X4.2 16.51,38.73 24.13,46.35 IC21.13
N$72
  Top 0.61: IC21.2 34.29,41.27 35.56,42.55 35.56,43.81 37.47,45.72 39.14,45.72 C17.1
N$73
  Top 0.61: IC21.6 35.56,51.44 38.1,53.98 38.97,53.98 C18.1
N$74
  Bottom 1.778: 14.61,67.94 Q2.D | Q2.D 14.61,67.31 | Q2.D 14.61,72.39 17.78,75.56 17.78,80.64 16.51,81.92 13.38,81.92 X1.2
N$75
  Bottom 0.406: R11.1 40.01,13.34 47.62,20.95 U$1.P$15
N$76
  Bottom 0.406: R12.1 40.01,11.43 46.99,18.41 U$1.P$16 48.9,18.41
N$77  (via drill 0.6)
  Top 0.61: v15.88,12.7 STATUS.2
  Bottom 0.406: 36.83,11.43 34.92,9.53 19.05,9.53 v15.88,12.7
  Bottom 0.61: R12.2 36.83,11.43
N$78  (via drill 0.6)
  Top 0.61: v20.95,12.7 TX.2
  Bottom 0.406: 36.83,13.34 34.29,10.79 22.86,10.79 v20.95,12.7
  Bottom 0.61: R11.2 36.83,13.34
N$79
  Bottom 1.27: 55.24,85.72 54.61,85.72 | 54.61,85.72 54.61,86.36 55.88,86.36 55.88,85.09 54.61,85.09 54.61,85.72
N$80
  Top 1.27: 54.61,85.72 55.24,85.72 54.61,86.36 | 54.61,85.72 54.61,86.36 | 54.61,86.36 55.88,86.36 55.88,85.09 54.61,85.09 54.61,85.72
N$93  (via drill 0.6)
  Top 0.406: v77.47,12.06 81.92,12.06 v84.45,14.61
  Bottom 0.406: IC13.3 78.74,10.79 v77.47,12.06 | v84.45,14.61 IC13.9
N$94  (via drill 0.6)
  Top 0.406: v69.85,59.05 v69.85,51.44
  Bottom 0.406: IC17.14 69.22,79.38 67.94,78.11 67.94,60.33 69.22,59.05 v69.85,59.05 | v69.85,51.44 IC16.9
N$95
  Top 1.27: C11.1 58.44,90.81 55.26,87.63 L2.2
  Bottom 0.61: R2.1 61.63,100.93 63.5,99.06
  Bottom 1.27: IC20.1 70.48,93.34 67.31,96.52 C14.+
  Bottom 1.778: L2.2 55.26,90.82 63.5,99.06 64.77,100.33 C14.+
N$96
  Bottom 1.27: D2.C 41.8,101.6 46.35,101.6 46.56,101.39 IC19.2 46.56,87.42 47.62,86.36 | L2.1 47.62,86.36 | 47.62,86.36 48.9,86.36 48.9,85.09 47.62,85.09 47.62,86.36
N$97
  Bottom 0.61: R2.2 R1.1 54.05,102.23 50.8,102.23 49.96,101.39 IC19.4
N$98
  Top 0.406: T1.1 56.2,49.84 55.88,49.53 55.88,45.72 56.52,45.09 R3.1
N$99
  Top 0.406: T1.3 U$1.P$24
N$100
  Top 0.406: R3.2 60.33,45.09 61.59,46.35 U$1.P$25
N$134
  Bottom 0.61: T2.3 90.81,98.59 | 90.81,98.59 92.4,98.59 R4.1 | Q1.B 88.65,103.76 90.81,101.6 90.81,98.59
N$136
  Bottom 0.61: Q1.E 84.07,102.13 T2.1
  Bottom 1.27: R5.2 83.31,104.91 Q1.E
N$139
  Bottom 0.406: S2.3 77.83,43.81 | 77.83,43.81 S2.4 | 77.83,43.81 66.67,43.81 64.14,41.27 U$1.P$27
N$140
  Bottom 0.406: U$1.P$26 62.23,43.81 61.59,43.18 61.59,38.1 62.23,37.47 67.31,37.47 71.75,33.02 74.93,33.02 76.2,31.75 76.2,27.74 S1.4 S1.3
N$141
  Bottom 0.406: S3.4 77.83,34.29 | 77.83,34.29 S3.3 | 77.83,34.29 71.75,34.29 67.31,38.73 U$1.P$28
N$143
  Top 0.61: U$1.P$23 64.14,51.44 69.22,46.35 69.44,46.35 C13.2
OE_RESET  (via drill 0.6)
  Top 0.406: v163.19,97.79 v136.53,97.79 | v136.53,97.79 123.83,97.79 121.92,99.69 v121.92,104.14 | v136.53,97.79 v181.61,97.79 | v181.61,101.6 186.06,101.6 189.87,97.79 189.87,76.2 193.04,73.03 193.04,24.13 187.96,19.05 187.96,15.24 184.78,12.06 184.78,8.89 184.15,8.26 167,8.26 165.1,6.35 156.84,6.35 v154.94,4.45
  Bottom 0.406: IC1.13 175.26,104.78 173.35,106.68 165.1,106.68 163.19,104.78 v163.19,97.79 | IC4.13 148.59,104.78 146.69,106.68 139.06,106.68 136.53,104.14 v136.53,97.79 | v121.92,104.14 IC5.13 | v181.61,97.79 v181.61,101.6 | v154.94,4.45 154.31,3.81 112.39,3.81 111.12,5.08 111.12,9.53 108.58,12.06 92.71,12.06 88.9,15.88 IC13.8
OE_SET
  Bottom 0.406: IC11.13 120.02,17.14 120.65,17.78 120.65,22.23 | 120.65,22.23 108.58,22.23 99.69,13.34 93.34,13.34 89.53,17.14 85.09,17.14 82.55,14.61 IC13.6 | 120.65,22.23 147.32,22.23 | 147.32,22.23 172.72,22.23 173.99,20.95 173.99,18.41 175.9,16.51 IC12.13 | IC10.13 149.22,16.51 147.32,18.41 147.32,22.23
RESET_01
  Top 0.61: CON3.19 163.83,51.44 163.83,69.85 CON4.21 165.1,73.66 184.15,73.66 185.42,74.93 IC2.18
RESET_02
  Top 0.61: CON4.22 162.56,52.07 156.21,45.72 155.57,45.72 CON3.21
  Bottom 0.61: CON4.22 163.83,69.85 163.83,72.39 165.1,73.66 181.61,73.66 182.88,74.93 IC2.17
RESET_03
  Top 0.61: CON3.23 154.31,46.99 155.57,46.99 161.29,52.7 161.29,69.85 CON4.23 163.83,74.93 179.07,74.93 180.34,76.2 IC2.16
RESET_04
  Top 0.61: CON4.24 160.02,53.34 154.94,48.26 153.03,48.26 CON3.25
  Bottom 0.61: CON4.24 161.29,69.85 161.29,72.39 163.83,74.93 176.53,74.93 177.8,76.2 IC2.15
RESET_05
  Top 0.61: CON3.27 151.76,49.53 154.31,49.53 158.75,53.98 158.75,69.85 CON4.25 162.56,76.2 173.99,76.2 175.26,77.47 IC2.14
RESET_06
  Top 0.61: CON4.26 157.48,54.61 153.67,50.8 150.5,50.8 CON3.29
  Bottom 0.61: CON4.26 158.75,69.85 158.75,72.39 162.56,76.2 171.45,76.2 172.72,77.47 IC2.13
RESET_07
  Top 0.61: CON3.31 149.22,52.07 153.03,52.07 156.21,55.24 156.21,69.85 CON4.27 161.29,77.47 168.91,77.47 170.18,78.74 IC2.12
RESET_08
  Top 0.61: CON4.28 154.94,55.88 152.4,53.34 147.96,53.34 CON3.33
  Bottom 0.61: CON4.28 156.21,69.85 156.21,72.39 161.29,77.47 166.37,77.47 167.64,78.74 IC2.11
RESET_09
  Top 0.61: CON4.29 153.67,69.85 153.67,56.52 151.76,54.61 146.69,54.61 CON3.35
  Bottom 0.61: CON4.29 152.4,76.2 158.75,82.55 IC6.18
RESET_10
  Top 0.61: CON4.30 152.4,57.15 151.13,55.88 145.41,55.88 CON3.37
  Bottom 0.61: IC6.17 156.21,82.55 151.13,77.47 151.13,69.85 CON4.30
RESET_11
  Top 0.61: CON4.31 151.13,69.85 151.13,58.42 149.86,57.15 144.15,57.15 CON3.39
  Bottom 0.61: IC6.16 153.67,81.92 149.86,78.11 CON4.31
RESET_12
  Top 0.61: CON4.32 149.86,59.69 148.59,58.42 142.88,58.42 CON3.41
  Bottom 0.61: IC6.15 151.13,81.28 148.59,78.74 148.59,69.85 CON4.32
RESET_13
  Top 0.61: CON4.33 148.59,69.85 148.59,60.96 147.32,59.69 141.6,59.69 CON3.43
  Bottom 0.61: IC6.14 148.59,80.64 147.32,79.38 CON4.33
RESET_14
  Top 0.61: CON4.34 147.32,62.23 146.05,60.96 140.34,60.96 CON3.45
  Bottom 0.61: IC6.13 146.05,69.85 CON4.34
RESET_15
  Top 0.61: CON4.35 146.05,69.85 146.05,63.5 144.78,62.23 139.06,62.23 CON3.47
  Bottom 0.61: IC6.12 143.51,80.64 144.78,79.38 CON4.35
RESET_16
  Top 0.61: CON4.36 144.78,64.77 143.51,63.5 137.79,63.5 CON3.49
  Bottom 0.61: IC6.11 140.97,81.28 143.51,78.74 143.51,69.85 CON4.36
RESET_17
  Bottom 0.61: CON4.37 142.24,78.11 139.7,80.64 133.99,80.64 132.08,82.55 IC7.18
RESET_18
  Bottom 0.61: CON4.38 140.97,69.85 140.97,77.47 139.06,79.38 132.72,79.38 129.54,82.55 IC7.17
RESET_19
  Bottom 0.61: CON4.39 139.7,76.83 138.43,78.11 131.44,78.11 127,82.55 IC7.16
RESET_20
  Bottom 0.61: CON4.40 138.43,69.85 138.43,76.2 137.79,76.83 130.18,76.83 124.46,82.55 IC7.15
RS485_EN
  Top 0.406: IC22.2 41.27,26.04 42.55,24.77 42.55,13.97 44.45,12.06 52.7,12.06 61.59,20.95 U$1.P$35
  Top 0.61: IC22.3 IC22.2
RX  (via drill 0.6)
  Top 0.406: IC22.1 31.75,23.5 30.48,24.77 30.48,29.21 31.11,29.84 | 31.11,29.84 37.47,29.84 v42.55,34.92 | IC21.12 27.3,48.9 27.94,48.26 27.94,39.37 29.21,38.1 29.21,31.75 31.11,29.84
  Bottom 0.406: v42.55,34.92 45.72,38.1 45.72,40.01 46.99,41.27 U$1.P$7
  Bottom 0.61: X2.2 19.05,53.34 23.5,48.9 IC21.12
SET/RESET
  Bottom 0.406: IC13.2 78.11,9.53 74.93,12.7 74.93,21.59 74.3,22.23 71.75,22.23 70.48,23.5 70.48,26.67 69.85,27.3 65.41,27.3 64.14,26.04 U$1.P$33 | IC13.1 IC13.2 | IC13.4 81.28,12.06 81.92,11.43 81.92,10.16 81.28,9.53 IC13.2
SET_01
  Top 0.61: IC3.18 158.75,22.86 157.48,24.13 157.48,40.01 CON3.20
  Bottom 0.61: CON3.20 154.94,42.55 154.94,46.99 155.57,47.62 178.44,47.62 189.23,58.42 189.23,69.85 CON4.1
SET_02
  Top 0.61: IC3.17 156.21,22.86 154.94,24.13 154.94,40.01 CON3.22
  Bottom 0.61: CON3.22 152.4,42.55 152.4,46.99 154.31,48.9 177.8,48.9 187.96,59.05 CON4.2
SET_03
  Top 0.61: IC3.16 153.67,22.86 152.4,24.13 152.4,40.01 CON3.24
  Bottom 0.61: CON3.24 149.86,42.55 149.86,46.35 153.67,50.16 177.16,50.16 186.69,59.69 186.69,69.85 CON4.3
SET_04
  Top 0.61: IC3.15 151.13,22.86 149.86,24.13 149.86,40.01 CON3.26
  Bottom 0.61: CON3.26 147.32,42.55 147.32,45.72 153.03,51.44 176.53,51.44 185.42,60.33 CON4.4
SET_05
  Top 0.61: IC3.14 148.59,22.86 147.32,24.13 147.32,40.01 CON3.28
  Bottom 0.61: CON3.28 144.78,42.55 144.78,52.07 145.41,52.7 175.9,52.7 184.15,60.96 184.15,69.85 CON4.5
SET_06
  Top 0.61: IC3.13 146.05,22.86 144.78,24.13 144.78,40.01 CON3.30
  Bottom 0.61: CON3.30 142.24,42.55 142.24,51.44 144.78,53.98 175.26,53.98 182.88,61.59 CON4.6
SET_07
  Top 0.61: IC3.12 143.51,22.86 142.24,24.13 142.24,40.01 CON3.32
  Bottom 0.61: CON3.32 139.7,42.55 139.7,50.8 144.15,55.24 174.62,55.24 181.61,62.23 181.61,69.85 CON4.7
SET_08
  Top 0.61: IC3.11 140.97,22.86 139.7,24.13 139.7,40.01 CON3.34
  Bottom 0.61: CON4.8 180.34,62.87 173.99,56.52 143.51,56.52 137.16,50.16 137.16,42.55 CON3.34
SET_09
  Top 0.61: IC8.18 132.08,22.23 135.89,26.04 CON3.36
  Bottom 0.61: CON3.36 134.62,42.55 134.62,49.53 142.88,57.78 173.35,57.78 179.07,63.5 179.07,69.85 CON4.9
SET_10
  Top 0.61: CON3.38 133.35,25.4 129.54,21.59 IC8.17
  Bottom 0.61: CON3.38 132.08,42.55 132.08,48.9 142.24,59.05 172.72,59.05 177.8,64.14 CON4.10
SET_11
  Top 0.61: IC8.16 127,21.59 130.81,25.4 CON3.40
  Bottom 0.61: CON3.40 129.54,42.55 129.54,48.26 141.6,60.33 172.09,60.33 176.53,64.77 176.53,69.85 CON4.11
SET_12
  Top 0.61: IC8.15 124.46,21.59 128.27,25.4 CON3.42
  Bottom 0.61: CON3.42 127,42.55 127,47.62 140.97,61.59 171.45,61.59 175.26,65.41 CON4.12
SET_13
  Top 0.61: IC8.14 121.92,21.59 125.73,25.4 CON3.44
  Bottom 0.61: CON3.44 124.46,42.55 124.46,46.99 140.34,62.87 170.81,62.87 173.99,66.04 173.99,69.85 CON4.13
SET_14
  Top 0.61: IC8.13 119.38,21.59 123.19,25.4 CON3.46
  Bottom 0.61: CON3.46 121.92,42.55 121.92,46.35 139.7,64.14 170.18,64.14 172.72,66.67 CON4.14
SET_15
  Top 0.61: IC8.12 116.84,21.59 120.65,25.4 CON3.48
  Bottom 0.61: CON3.48 119.38,42.55 119.38,45.72 139.06,65.41 169.54,65.41 171.45,67.31 171.45,69.85 CON4.15
SET_16
  Top 0.61: IC8.11 114.3,21.59 118.11,25.4 CON3.50
  Bottom 0.61: CON3.50 116.2,43.18 116.2,44.45 138.43,66.67 168.28,66.67 CON4.16
SET_17
  Top 0.61: IC9.18 185.42,22.86 184.15,24.13 184.15,30.48 189.23,35.56 189.23,46.35 168.91,66.67 168.91,69.85 CON4.17
SET_18
  Top 0.61: IC9.17 182.88,22.86 181.61,24.13 181.61,29.84 187.96,36.2 187.96,45.72 167.64,66.04 CON4.18
SET_19
  Top 0.61: IC9.16 180.34,22.86 179.07,24.13 179.07,29.21 186.69,36.83 186.69,45.09 166.37,65.41 166.37,69.85 CON4.19
SET_20
  Top 0.61: IC9.15 177.8,22.86 176.53,24.13 176.53,28.57 185.42,37.47 185.42,44.45 165.1,64.77 CON4.20
SPALTEN_CLK  (via drill 0.6)
  Top 0.406: U$1.P$2 v57.78,53.98 57.78,56.52 68.58,67.31 70.48,67.31 71.75,68.58 71.75,72.39 73.66,74.3 v73.66,75.56
  Bottom 0.406: v57.78,53.98 60.33,53.98 61.59,52.7 65.41,52.7 66.67,53.98 IC16.11 | IC17.11 v73.66,75.56
SPALTEN_D
  Bottom 0.406: IC16.14 57.78,57.78 48.9,48.9 U$1.P$4
SPALTEN_LATCH  (via drill 0.6)
  Top 0.406: U$1.P$3 49.53,52.7 58.42,52.7 59.05,53.34 59.05,55.88 67.94,64.77 | v70.48,66.04 69.22,66.04 67.94,64.77 | v67.31,55.24 67.31,60.33 67.94,60.96 67.94,64.77
  Bottom 0.406: v67.31,55.24 IC16.12 | IC17.12 74.3,76.83 74.93,76.2 74.93,72.07 70.48,67.63 v70.48,66.04
SPALTEN_OE  (via drill 0.6)
  Top 0.406: v69.22,64.14 69.22,60.33 68.58,59.69 v68.58,56.52
  Bottom 0.406: IC16.13 v68.58,56.52 66.04,56.52 64.77,55.24 57.15,55.24 49.53,47.62 46.99,47.62 46.35,48.26 46.35,55.88 46.99,56.52 U$1.P$1 | IC17.13 69.85,78.11 69.22,77.47 v69.22,64.14
SPALTEN_RESET  (via drill 0.6)
  Top 0.406: v70.48,69.22 68.58,69.22 54.61,55.24 46.99,55.24 46.35,54.61 46.35,46.99 46.99,46.35 U$1.P$5
  Bottom 0.406: U$1.P$5 50.16,46.35 56.52,52.7 59.69,52.7 62.23,50.16 64.77,50.16 67.31,52.7 IC16.10 | IC17.10 71.86,70.59 v70.48,69.22
TX  (via drill 0.6)
  Top 0.406: v42.55,36.83 36.83,31.11 IC22.4 31.11,31.11 30.48,31.75 30.48,38.73 29.21,40.01 29.21,50.16 27.94,51.44 IC21.11
  Bottom 0.406: v42.55,36.83 44.45,38.73 44.45,40.64 47.62,43.81 U$1.P$6
  Bottom 0.61: X2.3 18.41,55.88 22.86,51.44 IC21.11
V_PP  (via drill 0.6, 0.9)
  Top 0.61: v88.9,100.97 84.45,100.97 v83.19,99.69 | CON4.44 135.89,69.85 135.89,80.64 IC6.10
  Top 1.27: v196.22,43.81 196.22,74.3 193.36,77.15 193.04,77.47 v193.04,85.72
  Bottom 0.61: T2.2 88.73,100.8 v88.9,100.97 | v83.19,99.69 83.19,99.06 81.28,97.16 80.78,97.16 R6.1
  Bottom 1.27: R6.1 80.78,97.03 80.78,95.12 D3.A 83.19,92.71 104.14,92.71 111.12,85.72 | 111.12,85.72 138.43,85.72 | 138.43,85.72 165.1,85.72 | 165.1,85.72 v193.04,85.72 | IC2.10 165.1,85.72 | IC6.10 138.43,85.72 | IC7.10 111.76,85.09 111.12,85.72 | IC8.9 111.76,27.94 113.67,29.84 138.43,29.84 | 138.43,29.84 165.1,29.84 | 165.1,29.84 168.28,29.84 179.07,40.64 CON3.2 CON3.1 v196.22,43.81 | IC9.9 165.1,29.84 | IC3.9 138.43,29.84
VCC  (via drill 0.6, 0.9)
  Top 0.406: LED1.2 56.69,63.96 58.74,61.91
  Top 0.61: CON3.6 175.26,40.01 175.26,36.83 168.28,29.84 167,29.84 166.37,29.21 166.37,16.51 | 166.37,16.51 v167.64,15.24 | CON4.45 133.35,72.39 133.35,83.19 136.53,86.36 136.53,95.89 | v94.61,83.19 94.61,67.94 | 94.61,67.94 94.61,66.04 IC15.14 | IC14.14 95.25,41.91 90.81,46.35 88.27,46.35 87,47.62 87,52.07 83.19,55.88 83.19,57.15 78.11,62.23 | 78.11,62.23 78.11,67.94 80.01,69.85 86.36,69.85 88.27,67.94 94.61,67.94 | 78.11,62.23 76.2,60.33 v73.66,60.33 | v111.76,100.33 111.76,95.89 | v113.03,12.06 113.03,8.89 113.67,8.26 138.43,8.26 | 138.43,8.26 156.84,8.26 165.1,16.51 166.37,16.51 | 138.43,8.26 v138.43,11.43 | IC22.8 26.67,23.5 27.94,24.77 | 27.94,24.77 27.94,34.92 | 27.94,34.92 27.94,37.47 26.67,38.73 IC21.16 | C12.1 27.94,34.92 | 27.94,24.77 31.11,21.59 35.56,21.59 v38.73,24.77
  Top 1.27: CON3.6 CON3.5 173.99,44.45 175.26,45.72 180.34,45.72 181.61,44.45 v181.61,41.27 | v103.5,90.81 108.58,95.89 111.76,95.89 136.53,95.89 v140.97,95.89 v167,95.89 v185.42,95.89 | v194.94,87.63 194.94,78.11 198.12,74.93 198.12,42.55 v196.22,40.64 | IC20.3 75.56,87 v71.75,83.19 71.12,82.55 71.12,74.3 58.74,61.91 55.24,58.42 53.98,58.42 | 53.98,58.42 46.35,58.42 44.45,56.52 v44.45,30.48 44.45,14.61 45.72,13.34 U$1.P$18 | C19.1 53.57,58.83 53.98,58.42
  Bottom 0.406: IC12.10 172.09,12.06 | 172.72,11.43 179.07,11.43 179.71,12.06 IC12.16 | IC5.16 125.73,100.97 125.09,100.33 118.75,100.33 | 118.75,100.33 118.11,100.97 | 118.11,100.97 IC5.10 | IC4.16 152.4,100.97 151.76,100.33 145.41,100.33 | 145.41,100.33 144.78,100.97 | 144.78,100.97 IC4.10 | IC1.16 179.07,100.97 178.44,100.33 172.09,100.33 | 172.09,100.33 171.45,100.97 | 171.45,100.97 IC1.10 | IC11.16 123.83,12.06 123.19,11.43 116.84,11.43 116.2,12.06 IC11.10 116.2,14.61 115.57,15.24 113.26,15.24 C6.1 | IC10.10 145.41,12.06 | 146.05,11.43 152.4,11.43 153.03,12.06 IC10.16 | 145.41,100.33 144.78,100.33 | 144.15,100.33 144.78,100.97 | 144.78,100.97 144.78,100.33 | 144.78,100.33 144.15,100.33 | 144.15,100.33 142.88,99.06 142.24,99.06 138.43,95.25 137.39,95.25 | 137.39,95.25 C2.1 136.75,94.84 137.16,95.25 137.39,95.25 | 172.09,100.33 171.45,100.33 | 171.45,100.97 171.45,100.33 | 171.45,100.33 169.54,98.42 168.28,98.42 165.1,95.25 165.1,95.02 C3.1 | 118.11,100.33 118.75,100.33 | 118.11,100.33 117.47,100.33 | 117.47,100.33 118.11,100.97 | 118.11,100.97 118.11,100.33 | 117.47,100.33 113.89,100.33 C1.1 | 172.09,12.06 172.72,11.43 | 172.72,11.43 172.09,11.43 | 171.45,11.43 172.09,12.06 | 172.09,12.06 172.09,11.43 | 172.09,11.43 171.45,11.43 | 171.45,11.43 167.87,11.43 C4.1 | 145.41,12.06 146.05,11.43 | 146.05,11.43 145.41,11.43 | 145.41,11.43 145.41,12.06 | 145.41,12.06 144.78,11.43 | 145.41,11.43 144.78,11.43 | 144.78,11.43 141.2,11.43 C5.1
  Bottom 0.61: IC17.16 69.85,81.92 69.22,82.55 69.22,84.45 69.85,85.09 C8.1 71.53,83.42 v71.75,83.19 | C7.1 70.48,63.5 69.22,62.23 69.22,60.96 69.85,60.33 IC16.16 v73.66,60.33 | v167.64,15.24 C4.1 | IC18.14 96.52,85.09 v94.61,83.19 | C1.1 111.99,100.56 v111.76,100.33 | C2.1 136.75,94.39 137.16,93.98 139.06,93.98 v140.97,95.89 | v167,95.89 165.97,95.89 C3.1 | v113.03,12.06 113.03,14.2 C6.1 | v138.43,11.43 140.74,11.43 C5.1 | v38.73,24.77 v44.45,30.48 | IC13.14 83.19,8.26 81.92,6.99 78.74,6.99 73.66,12.06 50.8,12.06 49.53,13.34 U$1.P$18
  Bottom 1.27: C16.2 75.8,91.03 IC20.3 97.16,90.81 | 97.16,90.81 v103.5,90.81 | IC18.14 97.16,90.81 | v185.42,95.89 187.32,93.98 187.32,88.9 188.59,87.63 v194.94,87.63 | v196.22,40.64 194.94,41.91 182.25,41.91 v181.61,41.27
VCC/2  (via drill 0.6)
  Top 0.61: CON4.43 134.62,82.55 v139.7,87.63
  Bottom 0.61: CON4.42 CON4.43 | 86.36,106.05 87,106.68 | 86.36,106.68 87,106.68 | 87,106.68 90.17,106.68 90.81,106.05 90.81,103.5 92.56,101.75 R4.2 94.61,99.85 94.61,94.61 | 92.08,94.61 D3.C 94.61,94.61 | v139.7,87.63 111.76,87.63 104.78,94.61 94.61,94.61
  Bottom 1.27: IC19.1 44.86,93.75 42.55,91.44 39.37,91.44 C9.+ | Q1.C 86.36,106.05 84.14,108.27 32.38,108.27 29.21,105.09 29.21,99.69 28.05,98.53 25.62,98.53 24.77,97.68 | 24.77,97.16 26.67,97.16 27.3,97.79 | 27.94,98.42 27.3,97.79 | 27.3,97.79 27.3,95.89
  Bottom 1.778: D4.C 24.77,97.68 25.51,97.68 27.3,95.89 C9.+
ZEILEN_CLK  (via drill 0.6)
  Top 0.406: v161.29,20.95 v161.29,24.77 | v134.62,20.95 134.62,23.5 135.89,24.77 v137.79,24.77 | v107.95,17.14 107.95,24.13 v109.22,25.4 | v165.74,100.33 v139.7,100.33 | v139.7,100.33 v135.25,100.33 | v139.7,100.33 185.42,100.33 188.59,97.16 188.59,75.56 191.77,72.39 v191.77,24.77 | v81.92,28.57 81.92,30.48 78.11,34.29 71.75,34.29 71.12,34.92 61.59,34.92 60.96,34.29 60.96,31.75 61.59,31.11 U$1.P$31
  Bottom 0.406: 109.22,24.77 108.58,24.77 99.69,15.88 94.61,15.88 v81.92,28.57 | 109.22,24.77 v137.79,24.77 v161.29,24.77 v191.77,24.77 | IC12.11 173.35,15.88 172.72,16.51 163.19,16.51 161.29,18.41 v161.29,20.95 | IC10.11 146.69,15.88 146.05,16.51 136.53,16.51 134.62,18.41 v134.62,20.95 | IC11.11 117.47,15.88 116.84,16.51 108.58,16.51 v107.95,17.14 | v109.22,25.4 109.22,24.77 | IC1.11 172.72,103.5 172.09,104.14 166.37,104.14 165.74,103.5 v165.74,100.33 | IC4.11 146.05,103.5 145.41,104.14 140.34,104.14 139.7,103.5 v139.7,100.33 | IC5.11 119.38,105.41 121.92,107.95 128.27,107.95 130.81,105.41 130.81,100.97 131.44,100.33 v135.25,100.33
ZEILEN_D  (via drill 0.6)
  Top 0.406: v182.88,102.87 186.69,102.87 191.13,98.42 191.13,76.83 194.31,73.66 194.31,23.5 189.23,18.41 189.23,14.61 186.06,11.43 186.06,8.26 184.78,6.99 167.64,6.99 165.74,5.08 v158.12,5.08 157.48,5.08 v154.94,2.54 | U$1.P$29 60.96,36.2 59.69,34.92 59.69,31.11 60.96,29.84 69.85,29.84 71.75,27.94 71.75,24.77 73.03,23.5 85.09,23.5 88.27,20.32 v88.27,14.61
  Bottom 0.406: IC10.14 150.5,15.24 152.4,17.14 156.84,17.14 158.12,15.88 v158.12,5.08 | IC1.14 176.53,103.5 178.44,105.41 180.34,105.41 v182.88,102.87 | v88.27,14.61 92.08,10.79 107.95,10.79 109.86,8.89 109.86,4.45 111.76,2.54 v154.94,2.54
ZEILEN_LATCH  (via drill 0.6)
  Top 0.406: v163.19,20.95 v163.19,23.5 | v136.53,20.95 v136.53,23.5 | v109.22,17.78 v109.22,23.5 | v133.99,99.06 v138.43,99.06 v164.47,99.06 184.78,99.06 187.32,96.52 187.32,74.93 190.5,71.75 190.5,25.4 v188.59,23.5 | v80.01,28.57 80.01,31.11 78.11,33.02 71.75,33.02 71.12,33.66 U$1.P$30
  Bottom 0.406: IC11.12 118.75,16.51 117.47,17.78 v109.22,17.78 | v163.19,20.95 163.19,18.41 163.83,17.78 173.35,17.78 174.62,16.51 IC12.12 | IC10.12 147.96,16.51 146.69,17.78 137.16,17.78 136.53,18.41 v136.53,20.95 | v188.59,23.5 v163.19,23.5 v136.53,23.5 v109.22,23.5 108.58,23.5 99.69,14.61 93.98,14.61 v80.01,28.57 | IC1.12 173.99,104.14 172.72,105.41 165.74,105.41 164.47,104.14 v164.47,99.06 | IC4.12 147.32,104.14 146.05,105.41 139.7,105.41 138.43,104.14 v138.43,99.06 | IC5.12 120.65,104.78 122.56,106.68 127.64,106.68 129.54,104.78 129.54,99.69 130.18,99.06 v133.99,99.06
ZEILEN_OE
  Bottom 0.406: U$1.P$32 66.36,28.57 | 66.36,28.57 70.48,28.57 71.75,27.3 71.75,24.13 72.39,23.5 74.93,23.5 76.2,22.23 76.2,13.97 76.83,13.34 IC13.5 IC13.10 | R13.2 66.36,28.57

## Text on the board
tPlace: 3A Fuse | 24 V | ULN2803 | ULN2803 | ULN2803 | Lampe | FlipDot Treiber | Power | SN7407 | für BROSE und LAWO / Prj. 43 von Thiro / @ThiroDragon | TX | RX | GND | 5V TTL | BROSE | LAWO | 60 Pin | 50 Pin | SN7407 | GND | RX | TX | RS232 | MAX232 | Schwarz | SN7407 | Lampe | GND | A | B | RS485 | MAX481 | UDN2981 | UDN2981 | UDN2981 | Gelb | RX | Status | BluePill | SW | Softw. Vers. : | www.furtec.de